# Altium project MAIN BOARD CERES.PrjPcb (part 2 of 2)

## Sheet Display.SchDoc: DISPLAY
size A4; Date: 30 08 2013; Author: Rachid AKKOUCHE; CompanyName: MDI; DrawnBy: Rachid AKKOUCHE; Engineer: Rachid AKKOUCHE; Organization: RASoftware; Address1: 52 J03, rue de la crèche; Address2: 77100 MEAUX; Address3: FRANCE; DocumentNumber: BRA201308307C; Revision: C; SheetNumber: 7; SheetTotal: 11; Telephone: +33651604047; Email: rachid.akkouche@wanadoo.fr; Proprietaire: MDI System; Dessinepar: -; Verifiepar: -; PageSetup: Record=PageOptions|CenterHorizontal=True|CenterVertical=True|PrintScale=1.00|XCorrection=1.00|YCorrection=1.00|PrintKind=1|BorderSize=5000000|LeftOffset=0|BottomOffset=0|Orientation=2|PaperLength=1000|PaperWidth=1000|Scale=100|PaperSource=1|PrintQuality=-3|MediaType=1|DitherType=10|PrintScaleMode=1|PaperKind=16K|PaperIndex=409; Time: 19:00
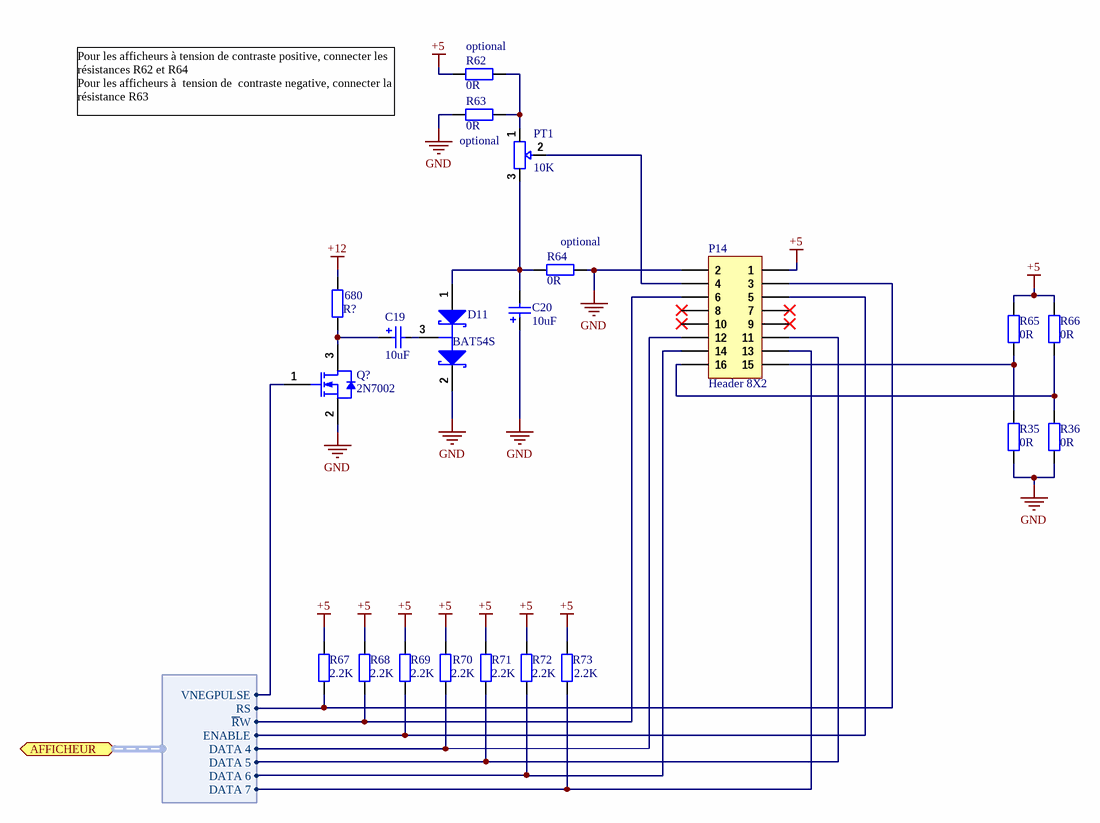
[diagram p8: Display.SchDoc]

### Parts
(Parts that share a designator on the sheet are numbered #1, #2 ... from top to bottom, then left to right.)
C19  10uF  [KEMET_4]
C20  10uF  [KEMET_4]
D11  BAT54S  [SOT-23]
P14  Header 8X2  [M20-2X8]
PT1  10K  [3361P]
Q?  2N7002  [SOT23]
R35  0R  [R0805]
R36  0R  [R0805]
R62  0R  [R0805]
R63  0R  [R0805]
R64  0R  [R0805]
R65  0R  [R0805]
R66  0R  [R0805]
R67  2.2K  [R0805]
R68  2.2K  [R0805]
R69  2.2K  [R0805]
R70  2.2K  [R0805]
R71  2.2K  [R0805]
R72  2.2K  [R0805]
R73  2.2K  [R0805]
R?#1  680  [R0805]

### Ports
AFFICHEUR (harness IO DISPLAY)

### Harnesses
IO DISPLAY: DATA 4, DATA 5, DATA 6, DATA 7, ENABLE, ~{R}W, RS, VNEGPULSE

### Nets
+5: P14.1 R62.2 R65.2 R66.2 R67.2 R68.2 R69.2 R70.2 R71.2 R72.2 R73.2
+12: R?#1.2
GND: C20.1 D11.2(K) P14.2 Q?.2(S) R35.1 R36.1 R63.2 R64.1
NetC19_1: C19.1 Q?.3(D) R?#1.1
NetC19_2: C19.2 D11.3(C)
NetC20_2: C20.2 D11.1(A) PT1.3 R64.2
NetP14_3: P14.3 R67.1 ; port AFFICHEUR.RS
NetP14_4: P14.4 PT1.2
NetP14_5: P14.5 R69.1 ; port AFFICHEUR.ENABLE
NetP14_6: P14.6 R68.1 ; port AFFICHEUR.~{R}W
NetP14_11: P14.11 R71.1 ; port AFFICHEUR.DATA 5
NetP14_12: P14.12 R70.1 ; port AFFICHEUR.DATA 4
NetP14_13: P14.13 R73.1 ; port AFFICHEUR.DATA 7
NetP14_14: P14.14 R72.1 ; port AFFICHEUR.DATA 6
NetP14_15: P14.15 R35.2 R65.1
NetP14_16: P14.16 R36.2 R66.1
NetPT1_1: PT1.1 R62.1 R63.1
NetQ?_1: Q?.1(G) ; port AFFICHEUR.VNEGPULSE

Not connected (* = marked no-connect by the designer): P14 7 8 9 10

### Notes on the sheet
- (near R62) optional
- Pour les afficheurs à tension de contraste positive, connecter les résistances R62 et R64
  Pour les afficheurs à  tension de  contraste negative, connecter la résistance R63
- optional
- (near R64) optional
- Ce document est la propriété de
- Project:
- Il ne peut être divulgué sans l'accord écrit de l'un de ses représentants dûment mandaté
- Title:
- Number:
- Date:
- Time:
- Size:
- A4
- Revision:
- Sheet
- of
- 52 J03 rue de la crèche
- Draw by:
- 77100 Meaux

### Library data of the parts
C19 C20 = Cap Pol 10uF: Polarized Capacitor; Manufacturer: KEMET; Manufacturer Part Number: EXV106M025A9BAA; Supplier 1: Farnell; Supplier Part Number 1: 2069174; RoHS: YES; Pricing 1: 10=0,111, 100=0,085, 500=0,074, 1000=0,07, 5000=0,066 (EUR); ComponentLink1URL: http://www.farnell.com/datasheets/1500293.pdf; ComponentLink1Description: http://www.farnell.com/datasheets/1500293.pdf
D11 = BAT54S: Schottky Barrier Double Diode; Manufacturer: MULTICOMP; Published: 17-Sep-2003; LatestRevisionDate: 12-Dec-2006; LatestRevisionNote: IPC-7351 Footprint Added.; DatasheetVersion: 4-Mar-2002; PackageVersion: May-1999; PackageReference: SOT23; Publisher: Altium Limited; PackageDescription: 3-Pin SOT-23 Package 0.95 mm Pitch, 2.3 mm Lead Span; ComponentLink1Description: Manufacturer Link; ComponentLink1URL: http://www.semiconductors.philips.com/; ComponentLink2Description: Datasheet; ComponentLink2URL: http://www.semiconductors.philips.com/acrobat/datasheets/BAT54_SERIES_4.pdf; Supplier 1: Farnell; Supplier Part Number 1: 1621835; Manufacturer Part Number: BAT54S; RoHS: YES; Stock 1: 51548; Pricing 1: 10=0,102, 250=0,074, 1000=0,06, 3000=0,053 (EUR); ComponentLink3URL: http://www.farnell.com/datasheets/1317753.pdf; ComponentLink3Description: http://www.farnell.com/datasheets/1317753.pdf
P14 = Header 8X2: Header, 8-Pin, Dual row; Manufacturer: HARWIN; Manufacturer Part Number: M20-8760842; LatestRevisionDate: 17-Jul-2002; LatestRevisionNote: Re-released for DXP Platform.; Publisher: Altium Limited; Supplier 1: Farnell; Supplier Part Number 1: 1517392; RoHS: YES; Pricing 1: 10=1,4, 20=1,39, 50=1,38, 100=1,37, 250=1,33, 500=1,26 (EUR); ComponentLink1URL: http://www.farnell.com/datasheets/1089519.pdf; ComponentLink1Description: http://www.farnell.com/datasheets/1089519.pdf; ComponentLink2URL: http://www.farnell.com/datasheets/5481.pdf; ComponentLink2Description: http://www.farnell.com/datasheets/5481.pdf
PT1 = RV: Manufacturer: BOURNS; Manufacturer Part Number: 3361P-1-103GLF; Supplier 1: Farnell; Supplier Part Number 1: 1696060; RoHS: YES; Pricing 1: 5=0,79, 50=0,74, 100=0,67, 250=0,63, 750=0,58 (EUR); ComponentLink1URL: http://www.farnell.com/datasheets/1563530.igs; ComponentLink1Description: http://www.farnell.com/datasheets/1563530.igs; ComponentLink2URL: http://www.farnell.com/datasheets/1443095.pdf; ComponentLink2Description: http://www.farnell.com/datasheets/1443095.pdf; ComponentLink3URL: http://www.farnell.com/cad/1563578.stp; ComponentLink3Description: http://www.farnell.com/cad/1563578.stp
Q? = 2N7002: N-channel Enhancement Mode Field-effect Transistor; Manufacturer: NXP; Published: 17-Sep-2003; LatestRevisionDate: 12-Dec-2006; LatestRevisionNote: IPC-7351 Footprint Added.; DatasheetVersion: 27-Jul-2000; PackageVersion: May-1999; PackageReference: SOT23; Publisher: Altium Limited; PackageDescription: 3-Pin SOT-23 Package 0.95 mm Pitch, 2.3 mm Lead Span; ComponentLink1Description: Manufacturer Link; ComponentLink1URL: http://www.semiconductors.philips.com/; ComponentLink2Description: Datasheet; ComponentLink2URL: http://www.semiconductors.philips.com/acrobat/datasheets/2N7002_4.pdf; Supplier 1: Farnell; Supplier Part Number 1: 1510761; Manufacturer Part Number: 2N7002; RoHS: YES; Stock 1: 14389; Pricing 1: 5=0,177, 25=0,118, 100=0,044, 1000=0,037, 3000=0,028 (EUR); ComponentLink3URL: http://www.nxp.com/documents/spice_model/2N7002.LIB; ComponentLink3Description: http://www.nxp.com/documents/spice_model/2N7002.LIB; ComponentLink4URL: http://beta.nxp.com/documents/data_sheet/2N7002PV.pdf; ComponentLink4Description: http://beta.nxp.com/documents/data_sheet/2N7002PV.pdf
R35 R36 R62-R66 = Resistor 0805 0R: Resistor or Jumper; Manufacturer: MULTICOMP; Manufacturer Part Number: MCMR08X000 PTL; Product Range: MULTICOMP - MCMR Series; Résistance: 0; Puissance: 125; Tolérance de résistance: ± 0.05; Type de boîtier de résistance: 0805; Type de résistance: Céramique; Coefficient de température: -200ppm/°C à +400; Tension: 150; Type de packaging: Cut Tape; Resistor Mounting: CMS; Supplier 1: Farnell; Supplier Part Number 1: 2073603; RoHS: YES; Pricing 1: 100=0,011, 500=0,009, 1000=0,008 (EUR); MSL: MSL 1 - Illimité; ComponentLink1URL: http://www.farnell.com/datasheets/1716708.pdf; ComponentLink1Description: http://www.farnell.com/datasheets/1716708.pdf
R67-R73 = Resistor 0805 2.2K: Resistor; Manufacturer: MULTICOMP; Manufacturer Part Number: MC01W080512K2; Supplier 1: Farnell; RoHS: YES; Pricing 1: 5000=0,001 (EUR); ComponentLink1URL: http://www.farnell.com/datasheets/1729047.pdf; ComponentLink1Description: http://www.farnell.com/datasheets/1729047.pdf; Supplier Part Number 1: 2129138
R?#1 = Resistor 0805 680: Resistor

## Sheet MCU main.SchDoc: MCU
size A3; Date: 30 08 2013; Author: Rachid AKKOUCHE; CompanyName: MDI; DrawnBy: Rachid AKKOUCHE; Organization: RASoftware; Address1: 52 J03, rue de la crèche; Address2: 77100 MEAUX; Address3: FRANCE; DocumentNumber: BRA201308302C; Revision: C; SheetNumber: 2; SheetTotal: 11; Telephone: +33651604047; Email: rachid.akkouche@wanadoo.fr; Proprietaire: MDI System; Dessinepar: -; Verifiepar: -; Time: 19:00
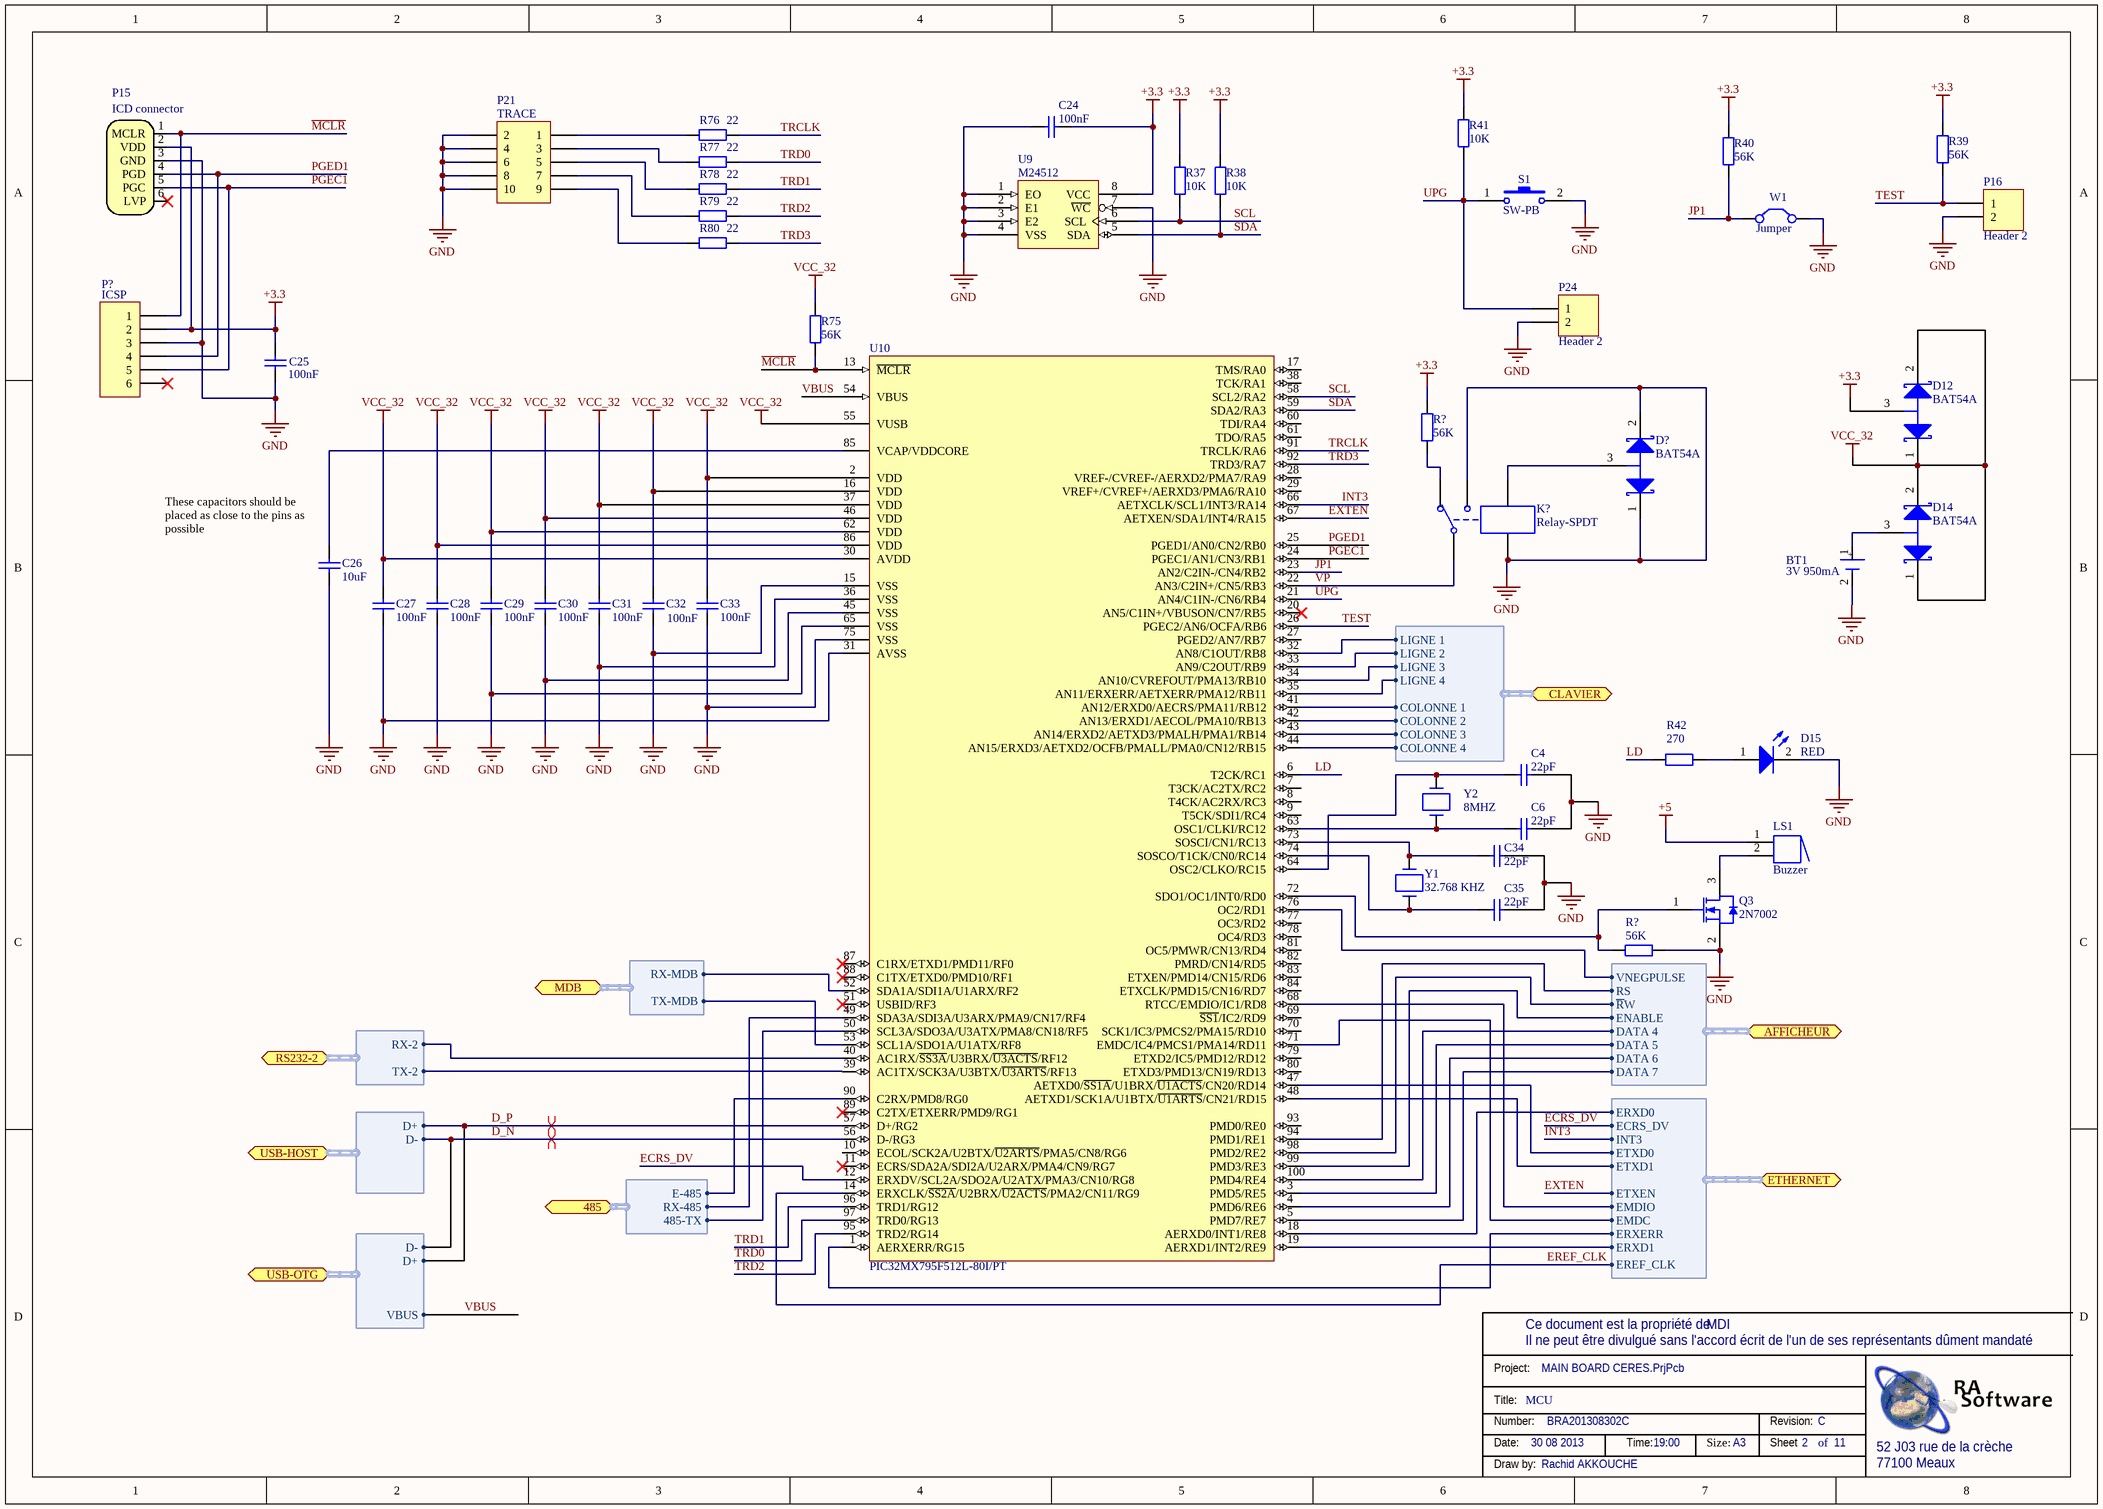
[diagram p9: MCU main.SchDoc]

### Parts
(Parts that share a designator on the sheet are numbered #1, #2 ... from top to bottom, then left to right.)
BT1  3V 950mA  [CR2477+SMTU]
C4  22pF  [C0805]
C6  22pF  [C0805]
C24  100nF  [C0805]
C25  100nF  [C0805]
C26  10uF
C27  100nF  [C0805]
C28  100nF  [C0805]
C29  100nF  [C0805]
C30  100nF  [C0805]
C31  100nF  [C0805]
C32  100nF  [C0805]
C33  100nF  [C0805]
C34  22pF  [C0805]
C35  22pF  [C0805]
D12  BAT54A  [SOT23]
D14  BAT54A  [SOT23]
D15  Couleur: RED  [0603-LEDR]  (hidden comment: HSMH-C190)
D?  BAT54A  [SOT23]
K?  Relay-SPDT  [MODULE5B]
LS1  Buzzer  [Buzzer ABI-017-RC]
P15  ICD connector  [TC2030-MCP]  (no BOM)
P16  Header 2  [M20_1X2]
P21  M20-8760542  [HE10_10PTS_CMS]  (value not drawn)
P24  Header 2  [M20_1X2]
P?  M20-8770642  [M20_1X6]  (value not drawn)
Q3  2N7002  [SOT23]
R37  10K  [R0805]
R38  10K  [R0805]
R39  56K  [R0805]
R40  56K  [R0805]
R41  10K  [R0805]
R42  270  [R0805]
R75  56K  [R0805]
R76  22  [R0805]
R77  22  [R0805]
R78  22  [R0805]
R79  22  [R0805]
R80  22  [R0805]
R?#2  56K  [R0805]
R?#3  56K  [R0805]
S1  SW-PB  [EVQQ2Y03W]
U9  M24512  [SOIC8]
U10  PIC32MX795F512L-80I/PT  [TQFP100pt]
W1  Jumper  [M20_1X2]
Y1  32.768 KHZ  [FSRLF]
Y2  8MHZ  [86SMX]

### Ports
485 (harness EIA-485), AFFICHEUR (harness IO DISPLAY), CLAVIER (harness KEYBOARD), ETHERNET (harness ETHERNET), MDB (harness MDB), RS232-2 (harness RS232_2), USB-HOST (harness USB-HOST), USB-OTG (harness USG-OTG)

### Harnesses
USB-HOST: D-, D+
USG-OTG: D-, D+, VBUS
RS232_2: TX-2, RX-2
ETHERNET: ETXEN, ETXD0, ETXD1, INT3, EMDIO, EMDC, ECRS_DV, ERXERR, ERXD0, ERXD1, EREF_CLK
IO DISPLAY: DATA 4, DATA 5, DATA 6, DATA 7, ENABLE, ~{R}W, RS, VNEGPULSE
KEYBOARD: COLONNE 1, COLONNE 2, COLONNE 3, COLONNE 4, LIGNE 1, LIGNE 2, LIGNE 3, LIGNE 4
EIA-485: 485-TX, RX-485, E-485
MDB: TX-MDB, RX-MDB

### Nets
+3.3: C24.1 C25.2 D12.3(A) P15.2(VDD) P?.2 R37.2 R38.2 R39.2 R40.2 R41.2 R?#2.2 U9.8(VCC)
+5: LS1.1
GND: BT1.2 C4.1 C6.1 C24.2 C25.1 C26.2 C27.1 C28.1 C29.1 C30.1 C31.1 C32.1 C33.1 C34.1 C35.1 D15.2(K) D?.1(K1) D?.2(K2) K?.3 K?.4 P15.3(GND) P16.2 P21.2 P21.4 P21.6 P21.8 P21.10 P24.2 P?.3 Q3.2(S) R?#3.1 S1.2 U9.1(EO) U9.2(E1) U9.3(E2) U9.4(VSS) U9.7(~{WC}) U10.15(VSS) U10.31(AVSS) U10.36(VSS) U10.45(VSS) U10.65(VSS) U10.75(VSS) W1.2(C2)
VCC_32: C27.2 C28.2 C29.2 C30.2 C31.2 C32.2 C33.2 D12.1(K1) D12.2(K2) D14.1(K1) D14.2(K2) R75.2 U10.2(VDD) U10.16(VDD) U10.30(AVDD) U10.37(VDD) U10.46(VDD) U10.55(VUSB) U10.62(VDD) U10.86(VDD)
D_N: U10.56(D-/RG3) ; port USB-HOST.D-, port USB-OTG.D-
D_P: U10.57(D+/RG2) ; port USB-HOST.D+, port USB-OTG.D+
ECRS_DV: U10.12(ERXDV/SCL2A/SDO2A/U2ATX/PMA3/CN10/RG8) ; port ETHERNET.ECRS_DV
EREF_CLK: U10.14(ERXCLK/~{SS2A}/U2BRX/~{U2ACTS}/PMA2/CN11/RG9) ; port ETHERNET.EREF_CLK
EXTEN: U10.67(AETXEN/SDA1/INT4/RA15) ; port ETHERNET.ETXEN
INT3: U10.66(AETXCLK/SCL1/INT3/RA14) ; port ETHERNET.INT3
JP1: R40.1 U10.23(AN2/C2IN-/CN4/RB2) W1.1(C1)  [project net JP1_2]
LD: R42.2 U10.6(T2CK/RC1)  [project net LD_2]
~{MCLR}: P15.1(MCLR) P?.1 R75.1 U10.13(~{MCLR})  [project net ~{MCLR}_2]
PGEC1: P15.5(PGC) P?.5 U10.24(PGEC1/AN1/CN3/RB1)  [project net PGEC1_2]
PGED1: P15.4(PGD) P?.4 U10.25(PGED1/AN0/CN2/RB0)  [project net PGED1_2]
SCL: R37.1 U9.6(SCL) U10.58(SCL2/RA2)  [project net SCL_2]
SDA: R38.1 U9.5(SDA) U10.59(SDA2/RA3)  [project net SDA_2]
TEST: P16.1 R39.1 U10.26(PGEC2/AN6/OCFA/RB6)  [project net TEST_2]
TRCLK: R76.1 U10.91(TRCLK/RA6)  [project net TRCLK_2]
TRD0: R77.1 U10.97(TRD0/RG13)  [project net TRD0_2]
TRD1: R78.1 U10.96(TRD1/RG12)  [project net TRD1_2]
TRD2: R79.1 U10.95(TRD2/RG14)  [project net TRD2_2]
TRD3: R80.1 U10.92(TRD3/RA7)  [project net TRD3_2]
UPG: P24.1 R41.1 S1.1 U10.21(AN4/C1IN-/CN6/RB4)  [project net UPG_2]
VBUS: U10.54(VBUS) ; port USB-OTG.VBUS
VP: K?.1 U10.22(AN3/C2IN+/CN5/RB3)  [project net VP_2]
NetBT1_1: BT1.1(+) D14.3(A)
NetC4_2: C4.2 U10.64(OSC2/CLKO/RC15) Y2.2
NetC6_2: C6.2 U10.63(OSC1/CLKI/RC12) Y2.1
NetC26_1: C26.1 U10.85(VCAP/VDDCORE)
NetC34_2: C34.2 U10.73(SOSCI/CN1/RC13) Y1.1
NetC35_2: C35.2 U10.74(SOSCO/T1CK/CN0/RC14) Y1.2
NetD1_3: U10.41(AN12/ERXD0/AECRS/PMA11/RB12) ; port CLAVIER.COLONNE 1
NetD2_3: U10.42(AN13/ERXD1/AECOL/PMA10/RB13) ; port CLAVIER.COLONNE 2
NetD3_3: U10.43(AN14/ERXD2/AETXD3/PMALH/PMA1/RB14) ; port CLAVIER.COLONNE 3
NetD4_3: U10.44(AN15/ERXD3/AETXD2/OCFB/PMALL/PMA0/CN12/RB15) ; port CLAVIER.COLONNE 4
NetD13_3: U10.52(SDA1A/SDI1A/U1ARX/RF2) ; port MDB.RX-MDB
NetD15_1: D15.1(A) R42.1
NetD?_3: D?.3(A) K?.5
NetK?_2: K?.2 R?#2.1
NetLS1_2: LS1.2 Q3.3(D)
NetP1_1: U10.32(AN8/C1OUT/RB8) ; port CLAVIER.LIGNE 1
NetP1_2: U10.33(AN9/C2OUT/RB9) ; port CLAVIER.LIGNE 2
NetP1_7: U10.35(AN11/ERXERR/AETXERR/PMA12/RB11) ; port CLAVIER.LIGNE 4
NetP1_8: U10.34(AN10/CVREFOUT/PMA13/RB10) ; port CLAVIER.LIGNE 3
NetP13_3: U10.39(AC1TX/SCK3A/U3BTX/~{U3ARTS}/RF13) ; port RS232-2.TX-2
NetP13_4: U10.40(AC1RX/~{SS3A}/U3BRX/~{U3ACTS}/RF12) ; port RS232-2.RX-2
NetP14_3: U10.94(PMD1/RE1) ; port AFFICHEUR.RS
NetP14_5: U10.99(PMD3/RE3) ; port AFFICHEUR.ENABLE
NetP14_6: U10.98(PMD2/RE2) ; port AFFICHEUR.~{R}W
NetP14_11: U10.3(PMD5/RE5) ; port AFFICHEUR.DATA 5
NetP14_12: U10.100(PMD4/RE4) ; port AFFICHEUR.DATA 4
NetP14_13: U10.5(PMD7/RE7) ; port AFFICHEUR.DATA 7
NetP14_14: U10.4(PMD6/RE6) ; port AFFICHEUR.DATA 6
NetP21_1: P21.1 R76.2
NetP21_3: P21.3 R77.2
NetP21_5: P21.5 R78.2
NetP21_7: P21.7 R79.2
NetP21_9: P21.9 R80.2
NetQ3_1: Q3.1(G) R?#3.2 U10.72(SDO1/OC1/INT0/RD0)
NetQ?_1: U10.76(OC2/RD1) ; port AFFICHEUR.VNEGPULSE
NetR21_2: U10.90(C2RX/PMD8/RG0) ; port 485.E-485
NetR34_2: U10.53(SCL1A/SDO1A/U1ATX/RF8) ; port MDB.TX-MDB
NetR53_2: U10.47(AETXD0/~{SS1A}/U1BRX/~{U1ACTS}/CN20/RD14) ; port ETHERNET.ETXD0
NetR54_2: U10.48(AETXD1/SCK1A/U1BTX/~{U1ARTS}/CN21/RD15) ; port ETHERNET.ETXD1
NetR56_1: U10.68(RTCC/EMDIO/IC1/RD8) ; port ETHERNET.EMDIO
NetU1_1: U10.49(SDA3A/SDI3A/U3ARX/PMA9/CN17/RF4) ; port 485.RX-485
NetU1_4: U10.50(SCL3A/SDO3A/U3ATX/PMA8/CN18/RF5) ; port 485.485-TX
NetU10_1: U10.1(AERXERR/RG15) ; port ETHERNET.ERXERR
NetU10_18: U10.18(AERXD0/INT1/RE8) ; port ETHERNET.ERXD0
NetU10_19: U10.19(AERXD1/INT2/RE9) ; port ETHERNET.ERXD1
NetU10_71: U10.71(EMDC/IC4/PMCS1/PMA14/RD11) ; port ETHERNET.EMDC

Not connected (* = marked no-connect by the designer): P15 6(LVP)*; P? 6*; U10 7(T3CK/AC2TX/RC2) 8(T4CK/AC2RX/RC3) 9(T5CK/SDI1/RC4) 10(ECOL/SCK2A/U2BTX/~{U2ARTS}/PMA5/CN8/RG6) 11(ECRS/SDA2A/SDI2A/U2ARX/PMA4/CN9/RG7)* 17(TMS/RA0) 20(AN5/C1IN+/VBUSON/CN7/RB5)* 27(PGED2/AN7/RB7) 28(VREF-/CVREF-/AERXD2/PMA7/RA9) 29(VREF+/CVREF+/AERXD3/PMA6/RA10) 38(TCK/RA1) 51(USBID/RF3)* 60(TDI/RA4) 61(TDO/RA5) 69(~{SS1}/IC2/RD9) 70(SCK1/IC3/PMCS2/PMA15/RD10) 77(OC3/RD2) 78(OC4/RD3) 79(ETXD2/IC5/PMD12/RD12) 80(ETXD3/PMD13/CN19/RD13) 81(OC5/PMWR/CN13/RD4) 82(PMRD/CN14/RD5) 83(ETXEN/PMD14/CN15/RD6) 84(ETXCLK/PMD15/CN16/RD7) 87(C1RX/ETXD1/PMD11/RF0)* 88(C1TX/ETXD0/PMD10/RF1)* 89(C2TX/ETXERR/PMD9/RG1)* 93(PMD0/RE0)

### Layout directives
differential pair: D_N, D_P

### Notes on the sheet
- (near C26) These capacitors should be placed as close to the pins as possible
- U2
- Ce document est la propriété de
- Project:
- Il ne peut être divulgué sans l'accord écrit de l'un de ses représentants dûment mandaté
- Title:
- Number:
- Date:
- Time:
- Size:
- A3
- Revision:
- Sheet
- of
- 52 J03 rue de la crèche
- Draw by:
- 77100 Meaux
- (in symbol Header 5X2) TRACE
- (in symbol Header 6) ICSP

### Library data of the parts
BT1 = Batterie: Manufacturer: RENATA; Manufacturer Part Number: CR2477N; Supplier 1: Farnell; Supplier Part Number 1: 4199200; RoHS: NA; Pricing 1: 1=2,66, 10=2,24, 100=1,98 (EUR); ComponentLink1URL: http://www.farnell.com/datasheets/8557.pdf; ComponentLink1Description: http://www.farnell.com/datasheets/8557.pdf; ComponentLink2URL: http://www.farnell.com/datasheets/1732059.pdf; ComponentLink2Description: http://www.farnell.com/datasheets/1732059.pdf; ComponentLink3URL: http://www.farnell.com/datasheets/1441997.pdf; ComponentLink3Description: http://www.farnell.com/datasheets/1441997.pdf; Supplier 2: Farnell; Supplier Part Number 2: 1216357; Pricing 2: 1=1,99, 25=1,76, 100=1,68, 250=1,59 (EUR); ComponentLink4URL: http://www.ryston.cz/windows-1250/renatabh.htm; ComponentLink4Description: http://www.ryston.cz/windows-1250/renatabh.htm; ComponentLink5URL: http://www.farnell.com/datasheets/1678381.pdf; ComponentLink5Description: http://www.farnell.com/datasheets/1678381.pdf
C4 C6 C34 C35 = Cap 0805 22pF: Capacitor; Manufacturer: YAGEO; Manufacturer Part Number: CC0805JRNPO9BN220; Supplier 1: Farnell; Supplier Part Number 1: 1816807; RoHS: YES; Pricing 1: 1=0,019, 25=0,016, 50=0,014, 100=0,011, 200=0,009, 1000=0,008 (EUR); ComponentLink1URL: http://www.farnell.com/datasheets/1132289.pdf; ComponentLink1Description: http://www.farnell.com/datasheets/1132289.pdf; Stock 1: 154
C24 C25 C27-C33 = Cap 0805 100nF: Capacitor; Manufacturer: MULTICOMP; Manufacturer Part Number: MCCA000296; Supplier 1: Farnell; Supplier Part Number 1: 1759167; Pricing 1: 100=0,01, 500=0,008, 1000=0,006, 4000=0,005 (EUR); ComponentLink1URL: http://www.farnell.com/datasheets/1520827.pdf; ComponentLink1Description: http://www.farnell.com/datasheets/1520827.pdf
C26 = Cap 0805 1uF: Capacitor; Manufacturer: YAGEO; Manufacturer Part Number: CC0805KKX5R5BB106; Unit: pcs; SuppliedAmount: 3000; MinAmount: 100; Capacitor type: ceramic; Capacitor kind: MLCC; Capacitance: 10µF; Operating voltage: 6.3V; Dielectric: X5R; Tolerance: ±10%; Supplier 1: TME; Supplier Part Number 1: CC0805KKX5R5106; Category: 0805 MLCC SMD Capacitors; Stock 1: 19000; Weight: 0,034; Multiples: 100; Mounting: SMD; Case: 0805; ComponentLink1URL: http://www.tme.eu/en/details/cc0805kkx5r5106/0805-mlcc-smd-capacitors/yageo/cc0805kkx5r5bb106/; ComponentLink1Description: http://www.tme.eu/en/details/cc0805kkx5r5106/0805-mlcc-smd-capacitors/yageo/cc0805kkx5r5bb106/
D12 D14 D? = BAT54A: Schottky Barrier Double Diode; Manufacturer: FAIRCHILD SEMICONDUCTOR; Courant, If moy.: 200; Tension, Vrrm: 30; Tension, Vf max..: 320; Temps trr max.: 5; Courant, Ifs max.: 600; Température d'utilisation min: -55; Température de fonctionnement max..: 150; Type de boîtier diode: SOT-23; Nombre de broches: 3; SVHC: No SVHC (20-Jun-2013); Configuration diode: Double anode commune; Courant, If, Vf: 1; Marquage, CMS: L42; Température de fonctionnement: -55°C à +150; Type de terminaison: SMD; Supplier 1: Farnell; Supplier Part Number 1: 1228222; Manufacturer Part Number: BAT54A; RoHS: YES; Pricing 1: 5=0,084, 25=0,082, 100=0,036, 1000=0,032, 3000=0,03 (EUR); Diode Type: Schottky; MSL: MSL 1 - Illimité; Température, Tj max..: 150; Type de boîtier: SOT-23; courant Ifsm: 600; ComponentLink1URL: http://www.farnell.com/datasheets/1718084.pdf; ComponentLink1Description: http://www.farnell.com/datasheets/1718084.pdf; ComponentLink2URL: http://www.farnell.com/datasheets/410597.pdf; ComponentLink2Description: http://www.farnell.com/datasheets/410597.pdf
D15 = HSMH-C190: Surface Mount Chip LED, Red; Manufacturer: AVAGO TECHNOLOGIES; Manufacturer Part Number: HSMH-C190.; Taille de lampe: 0.8mm x 1; Couleur de LED: Rouge; Intensité lumineuse: 17; Angle, vision: 170°; Courant, direct, If: 20; Tension, direct à  If: 1.8; Montage LED: CMS; Forme de lentille: Rectangulaire; Longueur d'onde typ.: 626; SVHC: No SVHC (19-Dec-2012); Dissipation de puissance: 65; Intensité lumineuse min. à  If: 2.8; Intensité lumineuse typique: 10; Largeur (externe): 0.8; Longueur d'onde dominante: 639; Longueur d'onde, crête: 630; Longueur/hauteur: 1.6; Matière: AlGaAs; Nombre de broches: 2; Orientation de montage opto: Dessus; Orientation sortie de lumière: Top Emitting; Température de fonctionnement: -30°C à +85; Température de fonctionnement max..: 85; Température, stockage min.: -40; Température d'utilisation min: -30; Tension, Vf max..: 2.6; Tension, Vf min.: 2.1; Type de LED: Standard; Supplier 1: Farnell; Supplier Part Number 1: 8554641; RoHS: YES; Stock 1: 13902; Pricing 1: 5=0,06, 25=0,059, 100=0,057, 250=0,052, 500=0,047 (EUR); MSL: MSL 2A - 4 semaines; Couleur, LED: Rouge; Profondeur: 0.8; Température, stockage max..: 85; Tension, Vf typ.: 1.8; ComponentLink1URL: http://www.farnell.com/datasheets/313031.pdf; ComponentLink1Description: http://www.farnell.com/datasheets/313031.pdf; ComponentLink2URL: http://www.farnell.com/datasheets/55927.pdf; ComponentLink2Description: http://www.farnell.com/datasheets/55927.pdf
K? = Relay-SPDT: Single-Pole Dual-Throw Relay; Published: 24-Mar-1999; LatestRevisionDate: 17-Jul-2002; LatestRevisionNote: Re-released for DXP Platform.; PackageReference: MODULE5B; Publisher: Altium Limited
LS1 = Buzzer: Magnetic Transducer Buzzer; Manufacturer: PRO SIGNAL; Manufacturer Part Number: ABI-017-RC; Tension, alimentation min.: 4; Tension, alimentation max..: 7; Courant de fonctionnement max..: 30; Niveau de bruit: 88; Distance, niveau sonore: 10; Fréquence de résonance: 2.4; Largeur (externe): 12.8; SVHC: No SVHC (19-Dec-2012); Poids: 2; Profondeur: 7.1; Température de fonctionnement max..: 70; Température d'utilisation min: -20; Supplier 1: Farnell; Supplier Part Number 1: 1504107; RoHS: YES; Pricing 1: 1=2,51, 10=2,23, 100=2,03, 250=1,88 (EUR); Transducer Function: Buzzer; Hauteur, dimension externe: 12.8; Consommation de courant: 30; Courant: 30; Hauteur: 12.8; Longueur/hauteur: 12.8; ComponentLink1URL: http://www.farnell.com/datasheets/1671249.pdf; ComponentLink1Description: http://www.farnell.com/datasheets/1671249.pdf; ComponentLink2URL: http://www.farnell.com/datasheets/1662050.pdf; ComponentLink2Description: http://www.farnell.com/datasheets/1662050.pdf
P15 = TC2030-MCP-NL: Conector par ICD
P16 P24 = Header 2: Header, 2-Pin; Manufacturer: HARWIN; Manufacturer Part Number: M20-8770242; Product Range: HARWIN - M20-87 Series; Terminaison du contact: PCB; Genre: Connecteur mâle; Nombre de contacts: 2; Nombre de rangées: 1; Pas: 2.54; Plaquage du contact: Or; Matériau du contact: Laiton; SVHC: No SVHC (20-Jun-2013); LatestRevisionDate: 17-Jul-2002; LatestRevisionNote: Re-released for DXP Platform.; Publisher: Altium Limited; Supplier 1: Farnell; Supplier Part Number 1: 1895211; RoHS: YES; Pricing 1: 10=0,137, 20=0,136, 50=0,135, 100=0,133, 250=0,128, 500=0,12 (EUR); ComponentLink1URL: http://www.farnell.com/cad/1330190.pdf; ComponentLink1Description: http://www.farnell.com/cad/1330190.pdf
P21 = Header 5X2: Header, 5-Pin, Dual row; Manufacturer: HARWIN; Type de connecteur: Contact fil-à-carte; Série: M20; Terminaison du contact: Montage en surface vertical; Genre: Embase; Nombre de contacts: 10; Nombre de rangées: 2; Pas: 2.54; Plaquage du contact: Or; Matériau du contact: Laiton; SVHC: No SVHC (19-Dec-2012); Supplier 1: Farnell; Supplier Part Number 1: 1517390; Manufacturer Part Number: M20-8760542; RoHS: YES; Stock 1: 4126; Pricing 1: 10=0,89, 20=0,75, 50=0,66, 100=0,55, 250=0,54, 500=0,53 (EUR); Pas, rang: 2.54; ComponentLink1URL: http://www.farnell.com/datasheets/1089515.pdf; ComponentLink1Description: http://www.farnell.com/datasheets/1089515.pdf; ComponentLink2URL: http://www.farnell.com/datasheets/5481.pdf; ComponentLink2Description: http://www.farnell.com/datasheets/5481.pdf
P? = Header 6: Header, 6-Pin; Manufacturer: HARWIN; Type de connecteur: Contact fil-à-carte; Série: M20; Terminaison du contact: Montage en surface vertical; Genre: Embase; Nombre de contacts: 6; Nombre de rangées: 1; Pas: 2.54; Plaquage du contact: Or; Matériau du contact: Laiton; SVHC: No SVHC (19-Dec-2012); Supplier 1: Farnell; Supplier Part Number 1: 1517384; Manufacturer Part Number: M20-8770642; RoHS: YES; Stock 1: 3471; Pricing 1: 10=0,69, 20=0,66, 50=0,62, 100=0,6, 250=0,56, 500=0,49 (EUR); Pas, rang: 2.54; ComponentLink1URL: http://www.farnell.com/datasheets/1089524.pdf; ComponentLink1Description: http://www.farnell.com/datasheets/1089524.pdf; ComponentLink2URL: http://www.farnell.com/datasheets/5481.pdf; ComponentLink2Description: http://www.farnell.com/datasheets/5481.pdf
Q3 = 2N7002: N-channel Enhancement Mode Field-effect Transistor; Manufacturer: STMICROELECTRONICS; Published: 17-Sep-2003; LatestRevisionDate: 12-Dec-2006; LatestRevisionNote: IPC-7351 Footprint Added.; DatasheetVersion: 27-Jul-2000; PackageVersion: May-1999; PackageReference: SOT23; Publisher: Altium Limited; PackageDescription: 3-Pin SOT-23 Package 0.95 mm Pitch, 2.3 mm Lead Span; ComponentLink1Description: Manufacturer Link; ComponentLink1URL: http://www.semiconductors.philips.com/; ComponentLink2Description: Datasheet; ComponentLink2URL: http://www.semiconductors.philips.com/acrobat/datasheets/2N7002_4.pdf; Supplier 1: Farnell; Supplier Part Number 1: 9512608; Manufacturer Part Number: 2N7002; RoHS: YES; Pricing 1: 1=0,56, 25=0,48, 100=0,44, 250=0,43, 1000=0,42 (EUR); ComponentLink3URL: http://www.st.com/web/en/resource/technical/document/datasheet/CD00005134.pdf; ComponentLink3Description: http://www.st.com/web/en/resource/technical/document/datasheet/CD00005134.pdf
R37 R38 R41 = Resistor 0805 10K: Resistor; Manufacturer: MULTICOMP; Manufacturer Part Number: MC0.1W08051%10KFR; Product Range: MULTICOMP - MC Series; Résistance: 10; Puissance: 100; Tolérance de résistance: ± 1%; Type de boîtier de résistance: 0805; Type de résistance: Couche épaisse; Coefficient de température: ± 100; Tension: 150; Type de packaging: Full Reel; Resistor Mounting: CMS; Supplier 1: Farnell; RoHS: YES; Pricing 1: 5000=0,001 (EUR); MSL: MSL 1 - Illimité; ComponentLink1URL: http://www.farnell.com/datasheets/1716700.pdf; ComponentLink1Description: http://www.farnell.com/datasheets/1716700.pdf; Supplier Part Number 1: 2129195
R39 R40 R75 R?#2 R?#3 = Resistor 0805 56K: Resistor; Manufacturer: MULTICOMP; Manufacturer Part Number: MC0.1W08051%56KFR; Product Range: MULTICOMP - MC Series; Résistance: 56; Puissance: 100; Tolérance de résistance: ± 1%; Type de boîtier de résistance: 0805; Type de résistance: Couche épaisse; Coefficient de température: ± 100; Tension: 150; Type de packaging: Full Reel; Resistor Mounting: CMS; Resistor Terminals: (Non Disponible); Supplier 1: Farnell; RoHS: YES; Pricing 1: 5000=0,001 (EUR); MSL: (Non Applicable); ComponentLink1URL: http://www.farnell.com/datasheets/1716700.pdf; ComponentLink1Description: http://www.farnell.com/datasheets/1716700.pdf; Supplier Part Number 1: 2129258
R42 = Resistor 0805 1K: Resistor; Manufacturer: MULTICOMP; Manufacturer Part Number: MC0.1W08051%1KFR; Product Range: MULTICOMP - MC Series; Résistance: 1; Puissance: 100; Tolérance de résistance: ± 1%; Type de boîtier de résistance: 0805; Type de résistance: Couche épaisse; Coefficient de température: ± 100; Tension: 150; Type de packaging: Full Reel; Resistor Mounting: CMS; Supplier 1: Farnell; RoHS: YES; Pricing 1: 5000=0,001 (EUR); MSL: MSL 1 - Illimité; ComponentLink1URL: http://www.farnell.com/datasheets/1716700.pdf; ComponentLink1Description: http://www.farnell.com/datasheets/1716700.pdf; Supplier Part Number 1: 2129113
R76-R80 = Resistor 0805 22: Resistor; Manufacturer: MULTICOMP; Manufacturer Part Number: MC01W0805122R; Product Range: MULTICOMP - MC Series; Puissance: 100; Tolérance de résistance: ± 1%; Type de boîtier de résistance: 0805; Type de résistance: Couche épaisse; Coefficient de température: ± 200; Tension: 150; Type de packaging: Full Reel; SVHC: No SVHC (20-Jun-2013); Resistor Mounting: CMS; Supplier 1: Farnell; RoHS: YES; Pricing 1: 5000=0,001 (EUR); Résistance: 22; MSL: -; ComponentLink1URL: http://www.farnell.com/datasheets/1729047.pdf; ComponentLink1Description: http://www.farnell.com/datasheets/1729047.pdf; Supplier Part Number 1: 2128982
S1 = SW-PB: Switch; Manufacturer: PANASONIC; Published: 24-Mar-1999; LatestRevisionDate: 17-Jul-2002; LatestRevisionNote: Re-released for DXP Platform.; PackageReference: SPST-2; Publisher: Altium Limited; PackageDescription: Switch; 2 Leads; Supplier 1: Farnell; Supplier Part Number 1: 9962875; Manufacturer Part Number: EVQQ2Y03W; RoHS: YES; Pricing 1: 1=0,34, 50=0,27, 100=0,23 (EUR); ComponentLink1URL: http://www.farnell.com/datasheets/28111.pdf; ComponentLink1Description: http://www.farnell.com/datasheets/28111.pdf
U9 = M24512-MN: EEPROM 512K I2C; Manufacturer: STMICROELECTRONICS; Manufacturer Part Number: M24512-WMN6P; Supplier 1: Farnell; RoHS: YES; Pricing 1: 1=1,2, 10=1,08, 100=0,96 (EUR); ComponentLink1URL: http://www.st.com/st-web-ui/static/active/en/resource/technical/document/datasheet/CD00251873.pdf; ComponentLink1Description: http://www.st.com/st-web-ui/static/active/en/resource/technical/document/datasheet/CD00251873.pdf; ComponentLink2URL: http://www.farnell.com/cad/1550662.zip; ComponentLink2Description: http://www.farnell.com/cad/1550662.zip; Supplier Part Number 1: 1670818
U10 = PIC32MX795F512L-80I/PT: High Performance 80 MHz MIPS-Based 32-Bit Flash Microcontroller with USB, CAN and Ethernet, 512KB Program Memory, 100-pin TQFP, Industrial Temperature; Published: 2-Dec-2009; DatasheetVersion: revB, Nov-2009; PackageVersion: revBB, Aug-2009; PackageReference: TQFP-PT100; Publisher: Altium Limited; PackageDescription: 100-Lead Plastic Thin Quad Flatpack (PT) - 12x12x1mm Body, 2.00mm [TQFP]; Supplier 1: Digi-Key; Supplier Part Number 1: 1778492; Supplier 2: Farnell; Supplier Part Number 2: 1778492; ComponentLink1Description: Datasheet; ComponentLink1URL: http://ww1.microchip.com/downloads/en/DeviceDoc/DS-61156B.pdf; ComponentLink2Description: Packaging Specification; ComponentLink2URL: http://ww1.microchip.com/downloads/en/PackagingSpec/en012702.pdf; ComponentLink3Description: Microchip.com Home; ComponentLink3URL: http://www.microchip.com/
W1 = Jumper: Jumper Wire; Manufacturer: HARWIN; Manufacturer Part Number: M20-8770242; Product Range: HARWIN - M20-87 Series; Terminaison du contact: PCB; Genre: Connecteur mâle; Nombre de contacts: 2; Nombre de rangées: 1; Pas: 2.54; Plaquage du contact: Or; Matériau du contact: Laiton; SVHC: No SVHC (20-Jun-2013); Published: 24-Mar-1999; LatestRevisionDate: 17-Jul-2002; LatestRevisionNote: Re-released for DXP Platform.; PackageReference: RAD-0.2; Publisher: Altium Limited; PackageDescription: Radial Cap, Thru-Hole; 2 Leads; 0.2 in Pin Spacing; Supplier 1: Farnell; Supplier Part Number 1: 1895211; RoHS: YES; Pricing 1: 10=0,137, 20=0,136, 50=0,135, 100=0,133, 250=0,128, 500=0,12 (EUR); ComponentLink1URL: http://www.farnell.com/cad/1330190.pdf; ComponentLink1Description: http://www.farnell.com/cad/1330190.pdf
Y1 = CRYSTAL2: Manufacturer: FOX ELECTRONICS; Manufacturer Part Number: FSRLF327.; Frequency: 32.768; Frequency Tolerance: ± 20; Load Capacitance: 12.5; Crystal Mounting Type: SMD; No. of Pins: 2; Supplier 1: Farnell; Supplier Part Number 1: 2058067; RoHS: YES; Pricing 1: 1=0,95, 6000=0,76, 9000=0,66, 30000=0,59, 51000=0,56 (EUR); Operating Temperature Min: -40; Operating Temperature Max: 85; ComponentLink1URL: http://www.foxonline.com/pdfs/fsrlf.pdf; ComponentLink1Description: http://www.foxonline.com/pdfs/fsrlf.pdf
Y2 = CRYSTAL2: Manufacturer: FOX ELECTRONICS; Manufacturer Part Number: FPXLF080-20; Supplier 1: Farnell; Supplier Part Number 1: 2064009; RoHS: YES; Pricing 1: 1=1,92, 10=1,25, 100=0,95, 250=0,89, 500=0,79, 3000=0,491, 3000=0,442, 20000=0,427 (EUR); ComponentLink1URL: http://www.foxonline.com/pdfs/fpxlf.pdf; ComponentLink1Description: http://www.foxonline.com/pdfs/fpxlf.pdf

## Sheet ETHERNET.SchDoc: Ethernet
size A4; Date: 31 08 2013; Author: Rachid AKKOUCHE; CompanyName: MDI; DrawnBy: Rachid AKKOUCHE; Engineer: Rachid AKKOUCHE; Organization: RASoftware; Address1: 52 J03, rue de la crèche; Address2: 77100 MEAUX; Address3: FRANCE; DocumentNumber: BRA2013083011C; Revision: C; SheetNumber: 11; SheetTotal: 11; Telephone: +33651604047; Email: rachid.akkouche@wanadoo.fr; IsUserConfigurable: Y; Proprietaire: MDI System; Dessinepar: -; Verifiepar: -; Time: 16:56
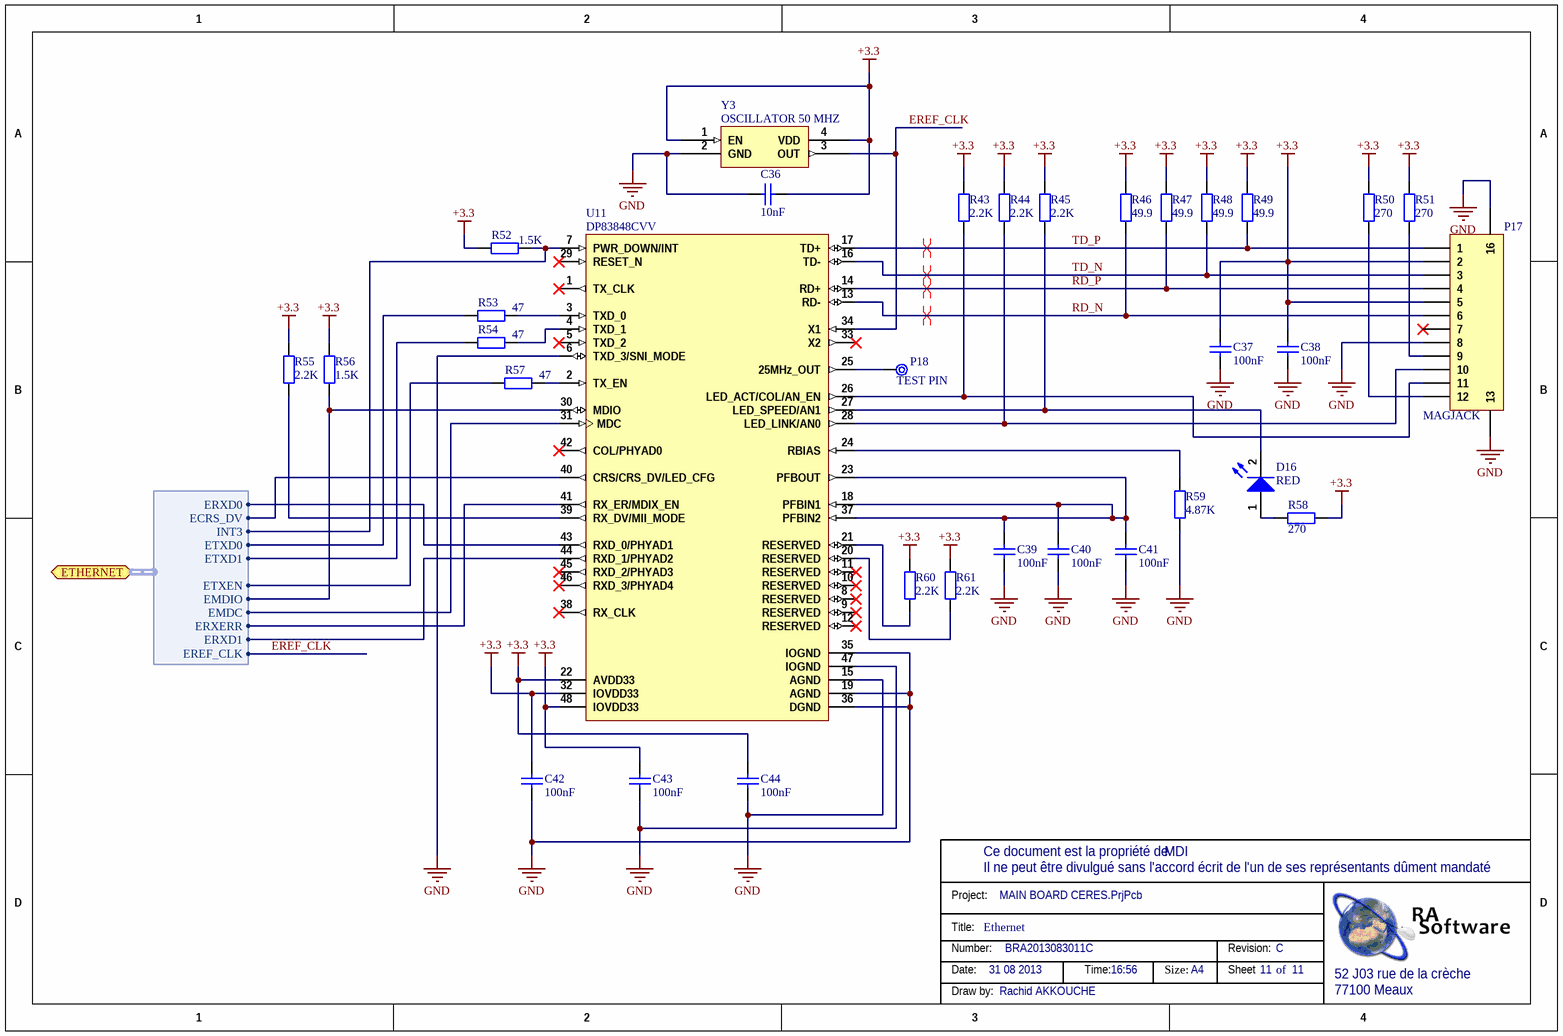
[diagram p10: ETHERNET.SchDoc]

### Parts
C36  10nF  [C0805]
C37  100nF  [C0805]
C38  100nF  [C0805]
C39  100nF  [C0805]
C40  100nF  [C0805]
C41  100nF  [C0805]
C42  100nF  [C0805]
C43  100nF  [C0805]
C44  100nF  [C0805]
D16  Couleur: RED  [0603-LEDR]  (hidden comment: HSMH-C190)
P17  MAGJACK  [RJ45_8+LED]
P18  TEST PIN  [TP]
R43  2.2K  [R0805]
R44  2.2K  [R0805]
R45  2.2K  [R0805]
R46  49.9  [R0805]
R47  49.9  [R0805]
R48  49.9  [R0805]
R49  49.9  [R0805]
R50  270  [R0805]
R51  270  [R0805]
R52  1.5K  [R0805]
R53  47  [R0805]
R54  47  [R0805]
R55  2.2K  [R0805]
R56  1.5K  [R0805]
R57  47  [R0805]
R58  270  [R0805]
R59  4.87K  [R0805]
R60  2.2K  [R0805]
R61  2.2K  [R0805]
U11  DP83848CVV  [LQFP48]
Y3  OSCILLATOR 50 MHZ  [X3225]

### Ports
ETHERNET (harness ETHERNET)

### Harnesses
ETHERNET: ETXEN, ETXD0, ETXD1, INT3, EMDIO, EMDC, ECRS_DV, ERXERR, ERXD0, ERXD1, EREF_CLK

### Nets
+3.3: C36.1 C37.1 C38.1 C42.1 C43.1 C44.1 P17.2 P17.5 R43.2 R44.2 R45.2 R46.2 R47.2 R48.2 R49.2 R50.2 R51.2 R52.2 R55.2 R56.2 R58.1 R60.2 R61.2 U11.22(AVDD33) U11.32(IOVDD33) U11.48(IOVDD33) Y3.1(EN) Y3.4(VDD)
GND: C36.2 C37.2 C38.2 C39.2 C40.2 C41.2 C42.2 C43.2 C44.2 P17.8 P17.13 P17.16 R59.1 U11.6(TXD_3/SNI_MODE) U11.15(AGND) U11.19(AGND) U11.35(IOGND) U11.36(DGND) U11.47(IOGND) Y3.2(GND)
ECRS_DV: U11.40(CRS/CRS_DV/LED_CFG) ; port ETHERNET.ECRS_DV
EREF_CLK: U11.34(X1) Y3.3(OUT) ; port ETHERNET.EREF_CLK
EXTEN: R57.2 ; port ETHERNET.ETXEN
INT3: R52.1 U11.7(PWR_DOWN/INT) ; port ETHERNET.INT3
RD_N: P17.6 R46.1 U11.13(RD-)  [project net RD_N_11]
RD_P: P17.4 R47.1 U11.14(RD+)  [project net RD_P_11]
TD_N: P17.3 R48.1 U11.16(TD-)  [project net TD_N_11]
TD_P: P17.1 R49.1 U11.17(TD+)  [project net TD_P_11]
NetC39_1: C39.1 C40.1 C41.1 U11.18(PFBIN1) U11.23(PFBOUT) U11.37(PFBIN2)
NetD16_1: D16.1(A) R58.2
NetD16_2: D16.2(K) R45.1 U11.27(LED_SPEED/AN1)
NetP17_9: P17.9 R51.1
NetP17_10: P17.10 R44.1 U11.28(LED_LINK/AN0)
NetP17_11: P17.11 R43.1 U11.26(LED_ACT/COL/AN_EN)
NetP17_12: P17.12 R50.1
NetP18_1: P18.1 U11.25(25MHz_OUT)
NetR53_1: R53.1 U11.3(TXD_0)
NetR53_2: R53.2 ; port ETHERNET.ETXD0
NetR54_1: R54.1 U11.4(TXD_1)
NetR54_2: R54.2 ; port ETHERNET.ETXD1
NetR55_1: R55.1 U11.39(RX_DV/MII_MODE)
NetR56_1: R56.1 U11.30(MDIO) ; port ETHERNET.EMDIO
NetR57_1: R57.1 U11.2(TX_EN)
NetR59_2: R59.2 U11.24(RBIAS)
NetR60_1: R60.1 U11.21(RESERVED)
NetR61_1: R61.1 U11.20(RESERVED)
NetU10_1: U11.41(RX_ER/MDIX_EN) ; port ETHERNET.ERXERR
NetU10_18: U11.43(RXD_0/PHYAD1) ; port ETHERNET.ERXD0
NetU10_19: U11.44(RXD_1/PHYAD2) ; port ETHERNET.ERXD1
NetU10_71: U11.31(MDC) ; port ETHERNET.EMDC

Not connected (* = marked no-connect by the designer): P17 7*; U11 1(TX_CLK)* 5(TXD_2)* 8(RESERVED)* 9(RESERVED)* 10(RESERVED)* 11(RESERVED)* 12(RESERVED)* 29(RESET_N)* 33(X2)* 38(RX_CLK)* 42(COL/PHYAD0)* 45(RXD_2/PHYAD3)* 46(RXD_3/PHYAD4)*

### Layout directives
differential pair: RD_N_11, RD_P_11, TD_N_11, TD_P_11

### Notes on the sheet
- Ce document est la propriété de
- Project:
- Il ne peut être divulgué sans l'accord écrit de l'un de ses représentants dûment mandaté
- Title:
- Number:
- Date:
- Time:
- Size:
- A4
- Revision:
- Sheet
- of
- 52 J03 rue de la crèche
- Draw by:
- 77100 Meaux

### Library data of the parts
C36 = Cap 0805 10nF: Capacitor; Manufacturer: MULTICOMP; Manufacturer Part Number: MC0805B103M500CT; Supplier 1: Farnell; RoHS: YES; Pricing 1: 1=0,009, 10=0,008, 100=0,008, 500=0,006, 1000=0,006 (EUR); ComponentLink1URL: http://www.newark.com/pdfs/datasheets/spc/Ta-1100.pdf; ComponentLink1Description: http://www.newark.com/pdfs/datasheets/spc/Ta-1100.pdf; Supplier Part Number 1: 1708707
C37-C44 = Cap 0805 100nF: as C24 on sheet MCU main; Supplier 1: Farnell; Supplier Part Number 1: 1759167; Pricing 1: 100=0,01, 500=0,008, 1000=0,006, 4000=0,005 (EUR); ComponentLink1URL: http://www.farnell.com/datasheets/1520827.pdf; ComponentLink1Description: http://www.farnell.com/datasheets/1520827.pdf
D16 = HSMH-C190: as D15 on sheet MCU main; Supplier 1: Farnell; Supplier Part Number 1: 8554641; RoHS: YES; Stock 1: 13902; Pricing 1: 5=0,06, 25=0,059, 100=0,057, 250=0,052, 500=0,047 (EUR); MSL: MSL 2A - 4 semaines; Couleur, LED: Rouge; Profondeur: 0.8; Température, stockage max..: 85; Tension, Vf typ.: 1.8; ComponentLink1URL: http://www.farnell.com/datasheets/313031.pdf; ComponentLink1Description: http://www.farnell.com/datasheets/313031.pdf; ComponentLink2URL: http://www.farnell.com/datasheets/55927.pdf; ComponentLink2Description: http://www.farnell.com/datasheets/55927.pdf
P17 = Header 12: Header, 12-Pin; Manufacturer: STEWART CONNECTOR; Manufacturer Part Number: SI-60062-F; LatestRevisionDate: 17-Jul-2002; LatestRevisionNote: Re-released for DXP Platform.; Publisher: Altium Limited; Supplier 1: Farnell; RoHS: YES; Stock 1: 1607; Pricing 1: 1=5,39, 10=5,07, 50=4,75, 100=4,65 (EUR); ComponentLink1URL: http://www.farnell.com/datasheets/1523782.pdf; ComponentLink1Description: http://www.farnell.com/datasheets/1523782.pdf; ComponentLink2URL: http://www.farnell.com/cad/1683659.pdf; ComponentLink2Description: http://www.farnell.com/cad/1683659.pdf; ComponentLink3URL: http://www.farnell.com/datasheets/79319.pdf; ComponentLink3Description: http://www.farnell.com/datasheets/79319.pdf; Supplier Part Number 1: 1137983
R43-R45 R55 R60 R61 = Resistor 0805 2.2K: as R67 on sheet Display; Supplier 1: Farnell; RoHS: YES; Pricing 1: 5000=0,001 (EUR); ComponentLink1URL: http://www.farnell.com/datasheets/1729047.pdf; ComponentLink1Description: http://www.farnell.com/datasheets/1729047.pdf; Supplier Part Number 1: 2129138
R46-R49 = Resistor 0805 49.9: Resistor; Manufacturer: MULTICOMP; Manufacturer Part Number: MC01W0805149R9; Product Range: MULTICOMP - MC Series; Puissance: 100; Tolérance de résistance: ± 1%; Type de boîtier de résistance: 0805; Type de résistance: Couche épaisse; Coefficient de température: ± 200; Tension: 150; Type de packaging: Full Reel; SVHC: No SVHC (20-Jun-2013); Resistor Mounting: CMS; Supplier 1: Farnell; RoHS: YES; Pricing 1: 5000=0,001 (EUR); Résistance: 49.9; MSL: (Non Applicable); ComponentLink1URL: http://www.farnell.com/datasheets/1729047.pdf; ComponentLink1Description: http://www.farnell.com/datasheets/1729047.pdf; Supplier Part Number 1: 2129011
R50 R51 = Resistor 0805 270: Resistor; Manufacturer: MULTICOMP; Manufacturer Part Number: MC01W08051270R; Product Range: MULTICOMP - MC Series; Puissance: 100; Tolérance de résistance: ± 1%; Type de boîtier de résistance: 0805; Type de résistance: Couche épaisse; Coefficient de température: ± 100; Tension: 150; Type de packaging: Full Reel; SVHC: No SVHC (20-Jun-2013); Resistor Mounting: CMS; Supplier 1: Farnell; Supplier Part Number 1: 2129067; RoHS: YES; Pricing 1: 5000=0,001 (EUR); Résistance: 270; MSL: -; ComponentLink1URL: http://www.farnell.com/datasheets/1729047.pdf; ComponentLink1Description: http://www.farnell.com/datasheets/1729047.pdf
R52 R56 = Resistor 0805 1.5K: Resistor; Manufacturer: MULTICOMP; Manufacturer Part Number: MC00625W040211K5; Supplier 1: Farnell; RoHS: YES; Pricing 1: 10000=0,001 (EUR); ComponentLink1URL: http://www.farnell.com/datasheets/1729045.pdf; ComponentLink1Description: http://www.farnell.com/datasheets/1729045.pdf; Supplier Part Number 1: 2130366
R53 R54 R57 = Resistor 0805 47: Resistor; Manufacturer: MULTICOMP; Manufacturer Part Number: MC0063W0603147R; Supplier 1: Farnell; RoHS: YES; Pricing 1: 5000=0,001 (EUR); ComponentLink1URL: http://www.farnell.com/datasheets/1729046.pdf; ComponentLink1Description: http://www.farnell.com/datasheets/1729046.pdf; Supplier Part Number 1: 2130751
R58 = Resistor 0805 1K: Resistor; Manufacturer: MULTICOMP; Manufacturer Part Number: MC01W08051270R; Product Range: MULTICOMP - MC Series; Puissance: 100; Tolérance de résistance: ± 1%; Type de boîtier de résistance: 0805; Type de résistance: Couche épaisse; Coefficient de température: ± 100; Tension: 150; Type de packaging: Full Reel; SVHC: No SVHC (20-Jun-2013); Resistor Mounting: CMS; Supplier 1: Farnell; Supplier Part Number 1: 2129067; RoHS: YES; Pricing 1: 5000=0,001 (EUR); Résistance: 270; MSL: -; ComponentLink1URL: http://www.farnell.com/datasheets/1729047.pdf; ComponentLink1Description: http://www.farnell.com/datasheets/1729047.pdf
R59 = Resistor 0805: Resistor; Manufacturer: MULTICOMP; Manufacturer Part Number: MC01W080514K87; Supplier 1: Farnell; Supplier Part Number 1: 2129169; RoHS: YES; Pricing 1: 5000=0,001 (EUR); ComponentLink1URL: http://www.farnell.com/datasheets/1729047.pdf; ComponentLink1Description: http://www.farnell.com/datasheets/1729047.pdf
U11 = DP83848CVV: PHYTER® Commercial Temperature Single Port 10/100 Mb/s Ethernet Physical Layer Transceiver, 48-pin LQFP; Manufacturer: National Semiconductor; PackageTopMarking: NSUZXYTT*DP83848VV*VBC; PowerWise: N; CompType: Interface IC; Published: 4-Dec-2008; DatasheetVersion: May-2008; PackageVersion: revE, May-2007; PackageReference: VBH48A; Publisher: Altium Limited; PackageDescription: LQFP, 7 x 7 x 1.4mm, 48 Lead, 0.5mm Pitch; Supplier 1: Farnell; Supplier Part Number 1: 1286816; Supplier 2: Farnell; Supplier Part Number 2: 1528379; PartNumber: DP83848CVV; RoHS: Y; PinCount: 48; ComponentLink1Description: DP83848C Datasheet; ComponentLink1URL: http://www.national.com/ds/DP/DP83848C.pdf; ComponentLink2Description: DP83848C Web Page; ComponentLink2URL: http://www.national.com/pf/DP/DP83848C.html; ComponentLink3Description: VBH48A Package Page; ComponentLink3URL: http://www.national.com/packaging/folders/vbh48a.html
Y3 = OSCILLLATOR: 50 MHZ 3.3Vdc CMOS SMD CRYSTAL CLOCK OSCILLATOR; Manufacturer: ABRACON; Manufacturer Part Number: ASE-50.000MHZ-LR-T; Fréquence: 50; Stabilité en fréquence: ± 25; Tension, alimentation min.: 3.135; Tension, alimentation max..: 3.465; Capacité, charge: 15; Oscillator Mounting: CMS; Nombre de broches: 4; Température d'utilisation min: -40; Température de fonctionnement max..: 85; SVHC: No SVHC (19-Dec-2012); Température de fonctionnement: -40°C à +85; Tension d'alimentation: 3.3; Supplier 1: Farnell; RoHS: YES; Pricing 1: 1=2,76, 10=2,38, 50=1,8, 100=1,6, 200=1,26, 500=1,22 (EUR); ComponentLink1URL: http://www.abracon.com/Oscillators/ASEseries.pdf; ComponentLink1Description: http://www.abracon.com/Oscillators/ASEseries.pdf; Supplier Part Number 1: 2101315

## Nets that join several sheets
+3.3: MDB (R13.2), KEYBOARD (12 pins), RS232 (R32.2), PSU (C9.1 P9.5 R28.2 U5.4), MCU main (12 pins), ETHERNET (28 pins)
+5: RS485 main (C1.1 R22.2 U1.8), MDB (D13.2 Q2.2 R16.2), RS232 (C14.1 C16.2 P13.2 U7.16), PSU (C7.1 P9.3 R27.2 U4.4), USB HOST (C2.1 P6.1), Display (11 pins), MCU main (LS1.1)
+12: PSU (11 pins), Display (R?#1.2)
+12/485: RS485 main (P4.1 P4.3 P5.1 P5.3), PSU (6 pins)
+36: MDB (P2.1 P19.1 P20.1), PSU (C11.1 C13.1 D6.1 U6.1)
GND: RS485 main (9 pins), MDB (10 pins), KEYBOARD (D1.1 D2.1 D3.1 D4.1), RS232 (8 pins), PSU (22 pins), USB HOST (C2.2 P6.4 P6.5 P6.6), USB OTG (7 pins), Display (8 pins), MCU main (44 pins), ETHERNET (20 pins)
D_N: USB HOST (P6.2), USB OTG (P7.2), MCU main (U10.56)
D_P: USB HOST (P6.3), USB OTG (P7.3), MCU main (U10.57)
ECRS_DV: MCU main (U10.12), ETHERNET (U11.40)
EREF_CLK: MCU main (U10.14), ETHERNET (U11.34 Y3.3)
EXTEN: MCU main (U10.67), ETHERNET (R57.2)
INT3: MCU main (U10.66), ETHERNET (R52.1 U11.7)
NetD1_3: KEYBOARD (D1.3 R9.1), MCU main (U10.41)
NetD2_3: KEYBOARD (D2.3 R10.1), MCU main (U10.42)
NetD3_3: KEYBOARD (D3.3 R11.1), MCU main (U10.43)
NetD4_3: KEYBOARD (D4.3 R12.1), MCU main (U10.44)
NetD13_3: MDB (D13.3 R17.2), MCU main (U10.52)
NetP1_1: KEYBOARD (P1.1 R1.2), MCU main (U10.32)
NetP1_2: KEYBOARD (P1.2 R2.2), MCU main (U10.33)
NetP1_7: KEYBOARD (P1.7 R4.2), MCU main (U10.35)
NetP1_8: KEYBOARD (P1.8 R3.2), MCU main (U10.34)
NetP13_3: RS232 (P13.3 U7.10), MCU main (U10.39)
NetP13_4: RS232 (P13.4 R30.1), MCU main (U10.40)
NetP14_3: Display (P14.3 R67.1), MCU main (U10.94)
NetP14_5: Display (P14.5 R69.1), MCU main (U10.99)
NetP14_6: Display (P14.6 R68.1), MCU main (U10.98)
NetP14_11: Display (P14.11 R71.1), MCU main (U10.3)
NetP14_12: Display (P14.12 R70.1), MCU main (U10.100)
NetP14_13: Display (P14.13 R73.1), MCU main (U10.5)
NetP14_14: Display (P14.14 R72.1), MCU main (U10.4)
NetQ?_1: Display (Q?.1), MCU main (U10.76)
NetR21_2: RS485 main (R21.2 U1.2 U1.3), MCU main (U10.90)
NetR34_2: MDB (R34.2), MCU main (U10.53)
NetR53_2: MCU main (U10.47), ETHERNET (R53.2)
NetR54_2: MCU main (U10.48), ETHERNET (R54.2)
NetR56_1: MCU main (U10.68), ETHERNET (R56.1 U11.30)
NetU1_1: RS485 main (U1.1), MCU main (U10.49)
NetU1_4: RS485 main (U1.4), MCU main (U10.50)
NetU10_1: MCU main (U10.1), ETHERNET (U11.41)
NetU10_18: MCU main (U10.18), ETHERNET (U11.43)
NetU10_19: MCU main (U10.19), ETHERNET (U11.44)
NetU10_71: MCU main (U10.71), ETHERNET (U11.31)
VBUS: USB OTG (C5.1 P7.1 R25.2), MCU main (U10.54)